# EAGLE design avrshift-uln2803 (EAGLE 6.6.0)
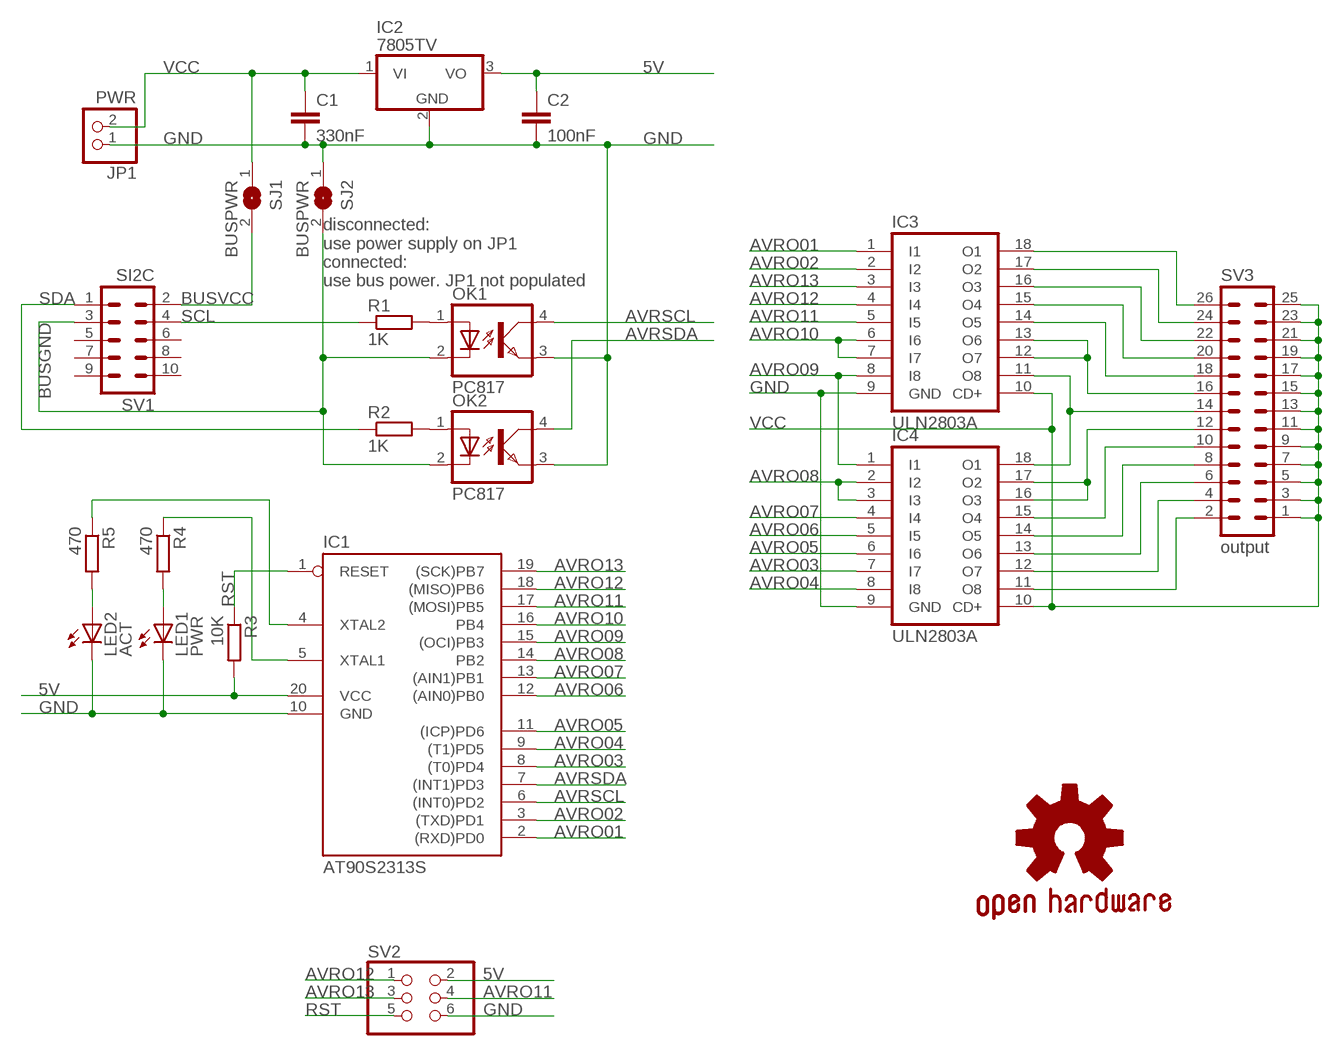
[diagram p0: schematic, sheet 1]

## Parts
C1  330nF  C2,5-3  [C2.5-3]
C2  100nF  C-EUC0805  [C0805]
GOLD_ORB_SM1  OSHWLOGO_GOLD_ORB_SM  [OSHW2]
IC1  AT90S2313S  [SO20L]
IC2  7805TV  [TO220V]
IC3  ULN2803A  [DIL18]
IC4  ULN2803A  [DIL18]
JP1  PWR  PINHD-1X2  [1X02]
LED1  PWR  LEDSML0805  [SML0805]
LED2  ACT  LEDSML0805  [SML0805]
OK1  PC817  [DIL04]
OK2  PC817  [DIL04]
R1  1K  R-EU_R0805  [R0805]
R2  1K  R-EU_R0805  [R0805]
R3  10K  R-EU_R0805  [R0805]
R4  470  R-EU_R0805  [R0805]
R5  470  R-EU_R0805  [R0805]
SJ1  BUSPWR  SJ  [SJ]
SJ2  BUSPWR  SJ  [SJ]
SV1  SI2C  ML10  [ML10]
SV2  PINHD-2X3  [2X03]
SV3  output  ML26  [ML26]

## Nets
5V: C2.1 IC1.20(VCC) IC2.3(VO) R3.2 SV2.2
AVRO01: IC1.2((RXD)PD0) IC3.1(I1)
AVRO02: IC1.3((TXD)PD1) IC3.2(I2)
AVRO03: IC1.8((T0)PD4) IC4.7(I7)
AVRO04: IC1.9((T1)PD5) IC4.8(I8)
AVRO05: IC1.11((ICP)PD6) IC4.6(I6)
AVRO06: IC1.12((AIN0)PB0) IC4.5(I5)
AVRO07: IC1.13((AIN1)PB1) IC4.4(I4)
AVRO08: IC1.14(PB2) IC4.2(I2) IC4.3(I3)
AVRO09: IC1.15((OCI)PB3) IC3.8(I8) IC4.1(I1)
AVRO10: IC1.16(PB4) IC3.6(I6) IC3.7(I7)
AVRO11: IC1.17((MOSI)PB5) IC3.5(I5) SV2.4
AVRO12: IC1.18((MISO)PB6) IC3.4(I4) SV2.1
AVRO13: IC1.19((SCK)PB7) IC3.3(I3) SV2.3
AVRSCL: IC1.6((INT0)PD2) OK1.4(COL)
AVRSDA: IC1.7((INT1)PD3) OK2.4(COL)
BUSGND: OK1.2(C) OK2.2(C) SJ2.2 SV1.3
BUSVCC: SJ1.2 SV1.2
GND: C1.2 C2.2 IC1.10(GND) IC2.2(GND) IC3.9(GND) IC4.9(GND) JP1.1 LED1.C LED2.C OK1.3(EMIT) OK2.3(EMIT) SJ2.1 SV2.6
N$1: OK1.1(A) R1.2
N$2: IC3.18(O1) SV3.26
N$4: OK2.1(A) R2.2
N$5: IC3.17(O2) SV3.24
N$6: IC3.16(O3) SV3.22
N$7: IC4.14(O5) SV3.8
N$8: LED2.A R5.2
N$9: IC4.13(O6) SV3.6
N$10: LED1.A R4.2
N$11: IC4.15(O4) SV3.10
N$12: IC4.16(O3) IC4.17(O2) SV3.12
N$13: IC3.11(O8) IC4.18(O1) SV3.14
N$14: IC3.12(O7) IC3.13(O6) SV3.16
N$15: IC3.14(O5) SV3.18
N$17: IC4.12(O7) SV3.4
N$18: IC4.11(O8) SV3.2
N$21: IC1.4(XTAL2) R5.1
N$25: IC3.15(O4) SV3.20
N$33: IC1.5(XTAL1) R4.1
RST: IC1.1(RESET) R3.1 SV2.5
SCL: R1.1 SV1.4
SDA: R2.1 SV1.1
VCC: C1.1 IC2.1(VI) IC3.10(CD+) IC4.10(CD+) JP1.2 SJ1.1 SV3.1 SV3.3 SV3.5 SV3.7 SV3.9 SV3.11 SV3.13 SV3.15 SV3.17 SV3.19 SV3.21 SV3.23 SV3.25
Unconnected: SV1.5 SV1.6 SV1.7 SV1.8 SV1.9 SV1.10

## Notes on the sheet
- disconnected:
  use power supply on JP1
  connected:
  use bus power. JP1 not populated

## Library data of the parts
C1 = capacitor-wima:C: CAPACITOR naming: grid - package width
C2 = rcl:C-EU: CAPACITOR, European symbol
GOLD_ORB_SM1 = bfl:OSHWLOGO: These are Open-Source Hardware logos.
IC1 = atmel:AT90S2313: MICROCONTROLLER 2 Kbytes FLASH 128 bytes SRAM 128 bytes EEPROM UART; OC_FARNELL: unknown; OC_NEWARK: unknown
IC2 = linear:78*: Positive VOLTAGE REGULATOR Source: http://cache.national.com/ds/LM/LM78L05.pdf http://www.fairchildsemi.com/ds/LM/LM7805.pdf
IC3 IC4 = uln-udn:ULN2803A: DRIVER ARRAY
JP1 = pinhead:PINHD-1X2: PIN HEADER
LED1 LED2 = led:LED: LED OSRAM: - CHIPLED LG R971, LG N971, LY N971, LG Q971, LY Q971, LO R971, LY R971 LH N974, LH R974 LS Q976, LO Q976, LY Q976 LO Q996 - Hyper CHIPLED LW Q18S LB Q993, LB Q99A, LB R99A - SideLED LS A670, LO A670, LY A670, LG A670, LP A670 LB A673, LV A673, LT A673, LW A673 LH A674 LY A675 LS A676, LA A676, LO A676, LY A676, LW A676 LS A679, LY A679, LG A679 - Hyper Micro SIDELED® LS Y876, LA Y876, LO Y876, LY Y876 LT Y87S - SmartLED LW L88C, LW L88S LB L89C, LB L89S, LG L890 LS L89K, LO L89K, LY L89K LS L896, LA L896, LO L896, LY L896 - TOPLED LS T670, LO T670, LY T670, LG T670, LP T670 LSG T670, LSP T670, LSY T670, LOP T670, LYG T670 LG T671, LOG T671, LSG T671 LB T673, LV T673, LT T673, LW T673 LH T674 LS T676, LA T676, LO T676, LY T676, LB T676, LH T676, LSB T676, LW T676 LB T67C, LV T67C, LT T67C, LS T67K, LO T67K, LY T67K, LW E67C LS E67B, LA E67B, LO E67B, LY E67B, LB E67C, LV E67C, LT E67C LW T67C LS T679, LY T679, LG T679 LS T770, LO T770, LY T770, LG T770, LP T770 LB T773, LV T773, LT T773, LW T773 LH T774 LS E675, LA E675, LY E675, LS T675 LS T776, LA T776, LO T776, LY T776, LB T776 LHGB T686 LT T68C, LB T68C - Hyper Mini TOPLED® LB M676 - Mini TOPLED Santana® LG M470 LS M47K, LO M47K, LY M47K Source: http://www.osram.convergy.de LUXEON: - LUMILED® LXK2-PW12-R00, LXK2-PW12-S00, LXK2-PW14-U00, LXK2-PW14-V00 LXK2-PM12-R00, LXK2-PM12-S00, LXK2-PM14-U00 LXK2-PE12-Q00, LXK2-PE12-R00, LXK2-PE12-S00, LXK2-PE14-T00, LXK2-PE14-U00 LXK2-PB12-K00, LXK2-PB12-L00, LXK2-PB12-M00, LXK2-PB14-N00, LXK2-PB14-P00, LXK2-PB14-Q00 LXK2-PR12-L00, LXK2-PR12-M00, LXK2-PR14-Q00, LXK2-PR14-R00 LXK2-PD12-Q00, LXK2-PD12-R00, LXK2-PD12-S00 LXK2-PH12-R00, LXK2-PH12-S00 LXK2-PL12-P00, LXK2-PL12-Q00, LXK2-PL12-R00 Source: www.luxeon.com KINGBRIGHT: KA-3528ASYC Source: www.kingbright.com
OK1 OK2 = optocoupler:PC817: SHARP OPTO COUPLER; MPN: PC817X4J000F; OC_FARNELL: 9707727; OC_NEWARK: 97K7059
R1-R5 = rcl:R-EU_: RESISTOR, European symbol
SJ1 SJ2 = jumper:SJ: SMD solder JUMPER
SV1 = con-harting-ml:ML10: HARTING; OC_FARNELL: unknown; OC_NEWARK: unknown
SV2 = pinhead:PINHD-2X3: PIN HEADER
SV3 = con-ml:ML26: HARTING; OC_FARNELL: unknown; OC_NEWARK: unknown

## Net classes
0 default: clearance 0.205 mm

## Board
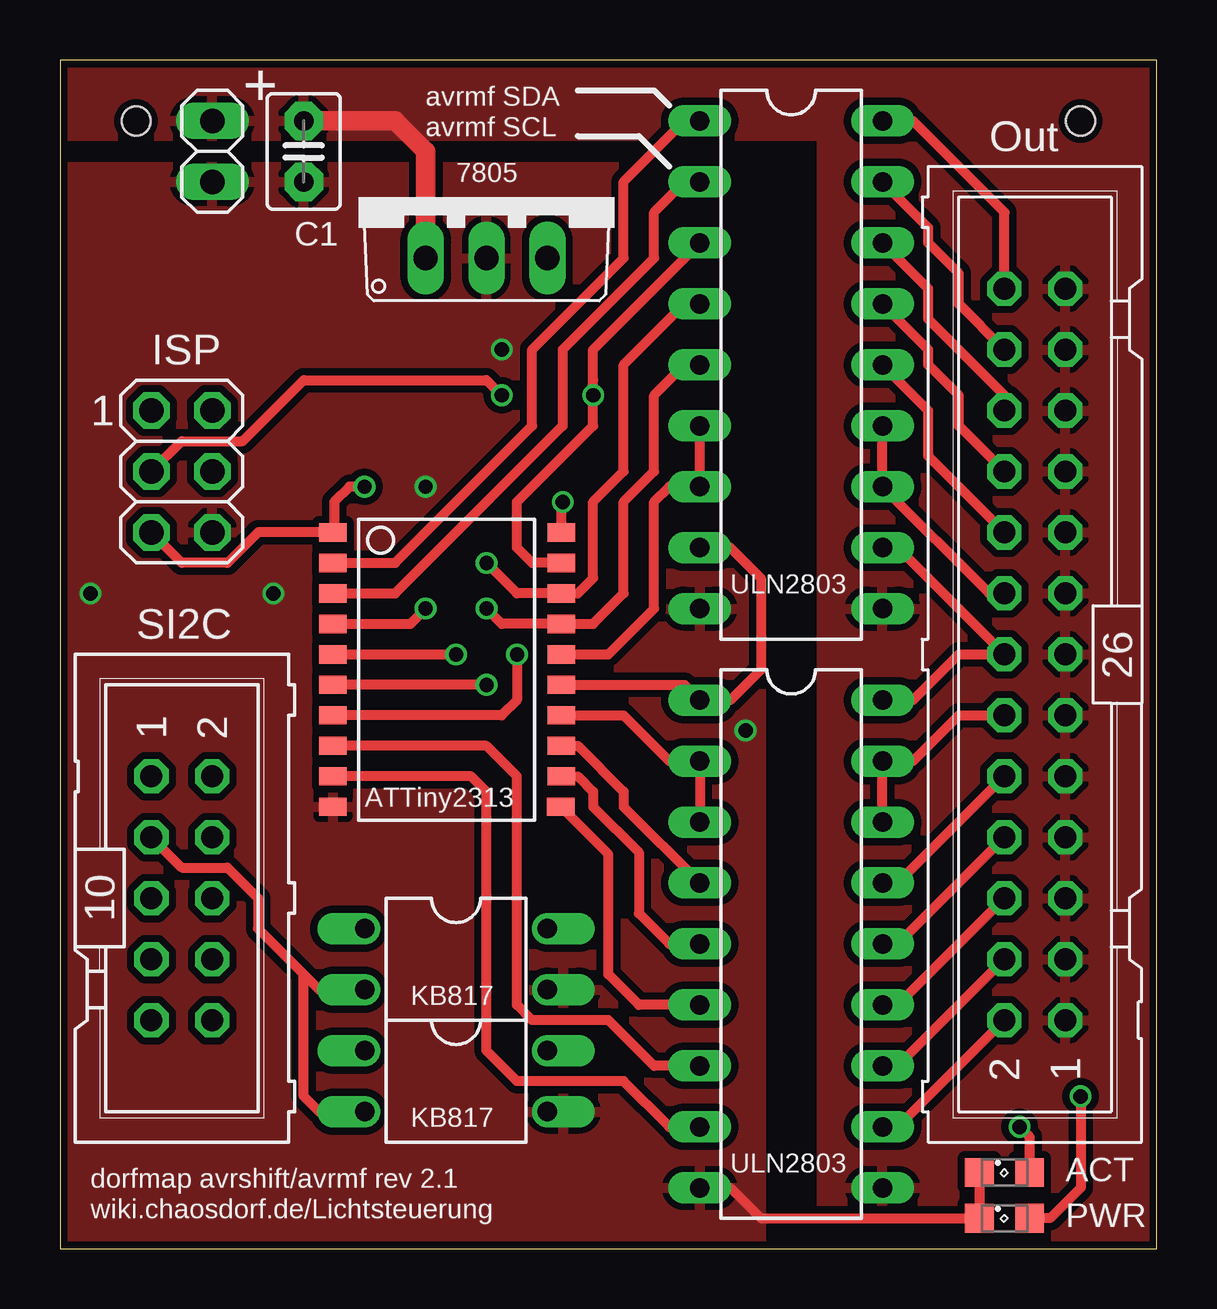
[diagram p1: board, top side]
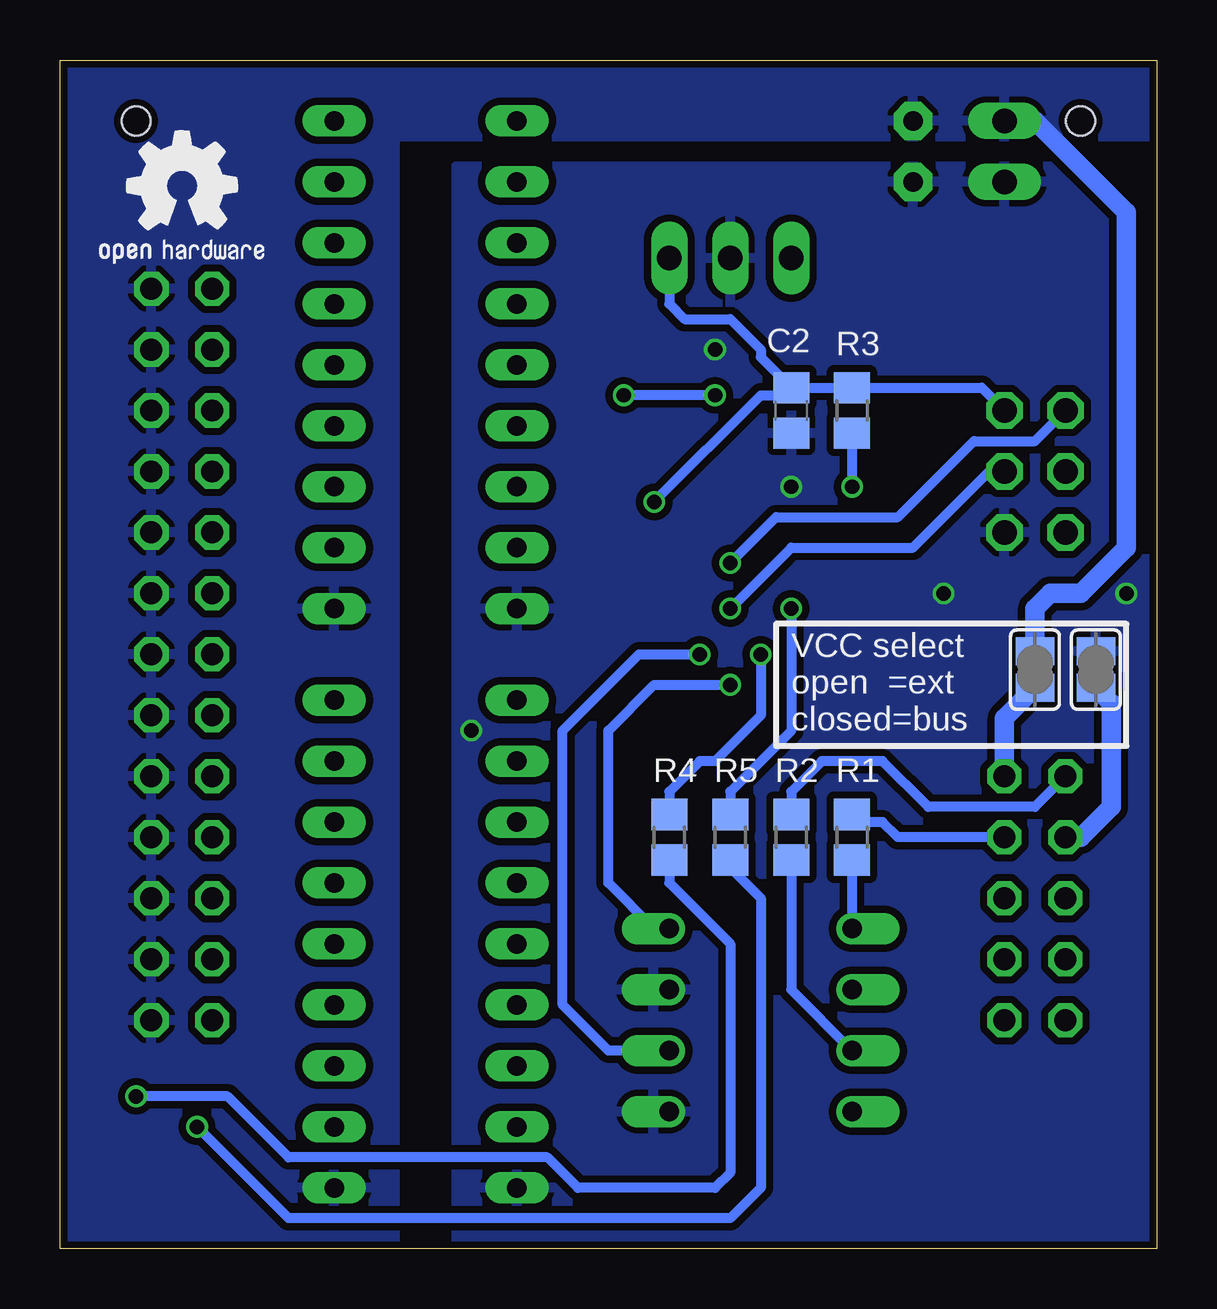
[diagram p2: board, bottom side, seen from below]

Size 45.72 x 49.53 mm. Coordinates in mm from the lower left corner, seen from the top.
Outline: 0,0 45.72,0 45.72,49.53 0,49.53 0,0
Copper layers (1*16): Top 0.035mm / dielectric 1.5mm / Bottom 0.035mm
Design rules "dirtypcbs_v1 *": minimum track width 5mil, minimum drill 12mil, track to track 5mil, track to pad 5mil, pad to pad 5mil, via to via 5mil, smd to smd 0mil, copper to edge 10mil, drill to drill 10mil, minimum pad ring 10mil, minimum via ring 6mil, stop-mask expansion 2mil, vias tented up to drill 25mil, thermal gap 10mil
Holes 1.2 mm at 42.55,46.99 3.17,46.99

### Footprints (pad centres in the part's own frame; a part is rotated, then mirrored left to right if it is on the bottom)
C2.5-3 = drill 0.813 pad 1.6 octagon: 1 -1.27,0; 2 1.27,0
C0805 = smd 1.3 x 1.5: 1 -0.95,0; 2 0.95,0
SO20L = smd 0.762 x 1.143: 1 -5.08,-5.131; 2 -3.81,-5.131; 3 -2.54,-5.131; 4 -1.27,-5.131; 5 0,-5.131; 6 1.27,-5.131; 7 2.54,-5.131; 8 3.81,-5.131; 9 5.08,-5.131; 10 6.35,-5.131; 11 6.35,4.369; 12 5.08,4.394; 13 3.81,4.394; 14 2.54,4.394; 15 1.27,4.394; 16 0,4.394; 17 -1.27,4.394; 18 -2.54,4.394; 19 -3.81,4.394; 20 -5.08,4.394
TO220V = drill 1.016 long: 1 -2.54,-2.54; 2 0,-2.54; 3 2.54,-2.54
DIL18 = drill 0.813 long: 1 -10.16,-3.81; 2 -7.62,-3.81; 3 -5.08,-3.81; 4 -2.54,-3.81; 5 0,-3.81; 6 2.54,-3.81; 7 5.08,-3.81; 8 7.62,-3.81; 9 10.16,-3.81; 10 10.16,3.81; 11 7.62,3.81; 12 5.08,3.81; 13 2.54,3.81; 14 0,3.81; 15 -2.54,3.81; 16 -5.08,3.81; 17 -7.62,3.81; 18 -10.16,3.81
1X02 = drill 1.016 long: 1 -1.27,0; 2 1.27,0
SML0805 = smd 1.2 x 1.2: A 1.05,0; C -1.05,0
DIL04 = drill 0.813 offset: 1 -1.27,-3.81; 2 1.27,-3.81; 3 1.27,3.81; 4 -1.27,3.81
R0805 = smd 1.3 x 1.5: 1 -0.95,0; 2 0.95,0
SJ = smd 1.168 x 1.6: 1 -0.762,0; 2 0.762,0
ML10 = drill 0.914 octagon: 1 -5.08,-1.27; 2 -5.08,1.27; 3 -2.54,-1.27; 4 -2.54,1.27; 5 0,-1.27; 6 0,1.27; 7 2.54,-1.27; 8 2.54,1.27; 9 5.08,-1.27; 10 5.08,1.27
2X03 = drill 1.016 octagon: 1 -2.54,-1.27; 2 -2.54,1.27; 3 0,-1.27; 4 0,1.27; 5 2.54,-1.27; 6 2.54,1.27
ML26 = drill 0.914 octagon: 1 -15.24,-1.27; 2 -15.24,1.27; 3 -12.7,-1.27; 4 -12.7,1.27; 5 -10.16,-1.27; 6 -10.16,1.27; 7 -7.62,-1.27; 8 -7.62,1.27; 9 -5.08,-1.27; 10 -5.08,1.27; 11 -2.54,-1.27; 12 -2.54,1.27; 13 0,-1.27; 14 0,1.27; 15 2.54,-1.27; 16 2.54,1.27; 17 5.08,-1.27; 18 5.08,1.27; 19 7.62,-1.27; 20 7.62,1.27; 21 10.16,-1.27; 22 10.16,1.27; 23 12.7,-1.27; 24 12.7,1.27; 25 15.24,-1.27; 26 15.24,1.27

### Placement (x,y rotation side)
C1  10.16,45.72 270 top
C2  15.24,34.92 270 bottom
GOLD_ORB_SM1  44.45,40.01 0 bottom
IC1  16.51,24.77 270 top
IC2  17.78,43.81 0 top
IC3  30.48,36.83 270 top
IC4  30.48,12.7 270 top
JP1  6.35,45.72 90 top
LED1  39.37,1.27 0 top
LED2  39.37,3.17 0 top
OK1  16.51,12.06 270 top
OK2  16.51,6.99 270 top
R1  12.7,17.14 270 bottom
R2  15.24,17.14 270 bottom
R3  12.7,34.92 90 bottom
R4  20.32,17.14 270 bottom
R5  17.78,17.14 270 bottom
SJ1  5.08,24.13 270 bottom
SJ2  2.54,24.13 270 bottom
SV1  5.08,14.61 270 top
SV2  5.08,32.38 270 top
SV3  40.64,24.77 90 top

### Tracks (layer width: path | path; a pad name or v marks a point on that pad's centre or on a via)
5V  (via drill 0.6)
  Top 0.406: IC1.20 20.9,31.06 v20.95,31.11
  Bottom 0.406: v20.95,31.11 16.51,35.56 15.55,35.56 C2.1 | IC2.3 20.32,39.37 19.68,38.73 17.78,38.73 16.51,37.47 16.51,37.15 C2.1 | C2.1 R3.2 7.3,35.88 SV2.2
AVRO01
  Top 0.406: IC3.1 26.04,46.99 23.5,44.45 23.5,41.27 19.68,37.47 19.68,34.29 13.97,28.57 IC1.2
AVRO02
  Top 0.406: IC1.3 13.97,27.3 20.95,34.29 20.95,37.47 24.77,41.27 24.77,43.18 26.04,44.45 IC3.2
AVRO03
  Top 0.406: IC4.7 24.77,7.62 22.86,9.53 19.68,9.53 19.05,10.16 19.05,19.68 17.78,20.95 IC1.8
AVRO04
  Top 0.406: IC4.8 25.4,5.08 23.5,6.99 19.05,6.99 17.78,8.26 17.78,19.05 17.14,19.68 IC1.9
AVRO05
  Top 0.406: IC4.6 24.13,10.16 22.86,11.43 22.86,16.43 IC1.11
AVRO06
  Top 0.406: IC1.12 21.59,19.68 22.23,19.05 22.23,18.41 24.13,16.51 24.13,13.97 25.4,12.7 IC4.5
AVRO07
  Top 0.406: IC1.13 21.59,20.95 23.5,19.05 23.5,18.41 IC4.4
AVRO08
  Top 0.406: IC4.3 IC4.2 25.4,20.32 23.5,22.23 IC1.14
AVRO09
  Top 0.406: IC3.8 27.94,29.21 29.21,27.94 29.21,24.13 27.94,22.86 IC4.1 26.04,23.5 IC1.15
AVRO10
  Top 0.406: IC3.6 IC3.7 25.4,31.75 24.77,31.11 24.77,26.67 22.86,24.77 IC1.16
AVRO11  (via drill 0.6)
  Top 0.406: IC3.5 26.04,36.83 24.77,35.56 24.77,32.38 23.5,31.11 23.5,27.3 22.23,26.04 IC1.17 18.41,26.04 v17.78,26.67
  Bottom 0.406: v17.78,26.67 15.24,29.21 10.16,29.21 6.99,32.38 SV2.4
AVRO12  (via drill 0.6)
  Top 0.406: IC3.4 26.04,39.37 23.5,36.83 23.5,32.38 22.23,31.11 22.23,27.94 21.59,27.3 IC1.18 19.05,27.3 v17.78,28.57
  Bottom 0.406: v17.78,28.57 15.88,30.48 10.79,30.48 7.62,33.66 5.08,33.66 SV2.1
AVRO13  (via drill 0.6)
  Top 0.406: IC1.19 19.68,28.57 19.05,29.21 19.05,31.11 22.23,34.29 v22.23,35.56 22.23,36.2 22.23,37.47 IC3.3 | SV2.3 5.08,33.66 7.62,33.66 10.16,36.2 17.78,36.2 v18.41,35.56
  Bottom 0.406: v18.41,35.56 v22.23,35.56
AVRSCL  (via drill 0.6)
  Top 0.406: v17.78,23.5 IC1.6
  Bottom 0.406: OK1.4 20.95,13.34 22.86,15.24 22.86,21.59 20.95,23.5 v17.78,23.5
AVRSDA  (via drill 0.6)
  Top 0.406: v19.05,24.77 19.05,22.86 18.41,22.23 IC1.7
  Bottom 0.406: OK2.4 22.86,8.26 24.77,10.16 24.77,21.59 21.59,24.77 v19.05,24.77
BUSGND
  Top 0.406: SV1.3 5.08,15.88 6.99,15.88 8.26,14.61 8.26,13.34 10.16,11.43 | 10.16,11.43 10.79,10.79 OK1.2 | OK2.2 10.79,5.71 10.16,6.35 10.16,11.43
  Bottom 0.813: SV1.3 3.17,17.14 1.91,18.41 1.91,22.73 SJ2.2
BUSVCC
  Bottom 0.813: SV1.2 6.35,22.1 SJ1.2
GND  (via drill 0.6)
  Top 0.406: LED2.C LED1.C | IC4.9 27.94,2.54 29.21,1.27 LED1.C | 38.1,1.27 LED1.C
  other vias: 1.27,27.3 15.24,31.75 8.89,27.3 18.41,37.47 28.57,21.59
  pour Top (isolate 0.305): 0,45.09 29.21,45.09 29.21,0 0,0
  pour Bottom (isolate 0.305): 0,0 0,45.09 29.21,45.09 29.21,0
N$1
  Bottom 0.406: R1.2 OK1.1
N$2
  Top 0.406: SV3.26 39.37,43.18 35.56,46.99 IC3.18 33.66,46.99
N$4
  Bottom 0.406: R2.2 15.24,10.79 OK2.1
N$5
  Top 0.406: SV3.24 37.47,39.37 37.47,40.64 36.2,41.91 36.2,42.55 IC3.17
N$6
  Top 0.406: SV3.22 39.37,35.56 36.2,38.73 36.2,40.01 IC3.16
N$7
  Top 0.406: IC4.14 34.92,12.7 SV3.8
N$8  (via drill 0.6)
  Top 0.406: LED2.A 40.42,4.67 v40.01,5.08
  Bottom 0.406: R5.2 17.78,15.88 16.51,14.61 16.51,2.54 17.78,1.27 36.2,1.27 v40.01,5.08
N$9
  Top 0.406: IC4.13 34.92,10.16 SV3.6
N$10  (via drill 0.6)
  Top 0.406: v42.55,6.35 42.55,2.54 41.27,1.27 LED1.A
  Bottom 0.406: R4.2 20.32,15.24 17.78,12.7 17.78,3.17 18.41,2.54 24.13,2.54 25.4,3.81 36.2,3.81 38.73,6.35 v42.55,6.35
N$11
  Top 0.406: IC4.15 34.92,15.24 SV3.10
N$12
  Top 0.406: IC4.16 IC4.17 35.56,20.32 37.47,22.23 SV3.12
N$13
  Top 0.406: IC3.11 34.92,29.21 SV3.14 37.47,24.77 35.56,22.86 IC4.18
N$14
  Top 0.406: SV3.16 38.73,27.3 IC3.12 IC3.13
N$15
  Top 0.406: SV3.18 36.2,33.02 36.2,34.92 IC3.14
N$17
  Top 0.406: IC4.12 34.92,7.62 SV3.4
N$18
  Top 0.406: IC4.11 34.92,5.08 SV3.2
N$21  (via drill 0.6)
  Top 0.406: IC1.4 14.61,26.04 v15.24,26.67
  Bottom 0.406: v15.24,26.67 15.24,21.59 17.78,19.05 R5.1
N$25
  Top 0.406: SV3.20 37.47,34.29 37.47,35.56 36.2,36.83 36.2,37.47 IC3.15
N$33  (via drill 0.6)
  Top 0.406: IC1.5 v16.51,24.77
  Bottom 0.406: v16.51,24.77 16.51,22.23 18.41,20.32 19.05,20.32 20.32,19.05 R4.1
RST  (via drill 0.6)
  Top 0.406: SV2.5 5.08,28.57 6.99,28.57 8.26,29.84 IC1.1 11.43,29.9 11.43,31.11 12.06,31.75 v12.7,31.75
  Bottom 0.406: R3.1 v12.7,31.75
SCL
  Bottom 0.406: SV1.4 10.79,17.14 11.43,17.78 12.38,17.78 R1.1
SDA
  Bottom 0.406: SV1.1 5.08,18.41 9.53,18.41 11.43,20.32 13.97,20.32 15.24,19.05 R2.1
VCC
  Top 0.813: C1.1 13.97,46.99 15.24,45.72 IC2.1
  Bottom 0.813: SJ1.1 5.08,26.67 4.45,27.3 3.17,27.3 1.27,29.21 1.27,43.18 5.08,46.99 JP1.2
  pour Top (isolate 0.305): 0,49.53 45.72,49.53 45.72,0 31.75,0 31.75,46.35 0,46.35
  pour Bottom (isolate 0.305): 0,49.53 45.72,49.53 45.72,0 31.75,0 31.75,46.35 0,46.35

### Text on the board
tNames: + | avrmf SDA | avrmf SCL | Out | 7805 | ISP | 1 | ULN2803 | SI2C | ATTiny2313 | KB817 | KB817 | dorfmap avrshift/avrmf rev 2.1 | ULN2803 | wiki.chaosdorf.de/Lichtsteuerung
bNames: VCC select / open =ext / closed=bus